# Altium schematic sheet Telemetria_Sensores.SchDoc
size A4; SheetNumber: 4; SheetTotal: 4
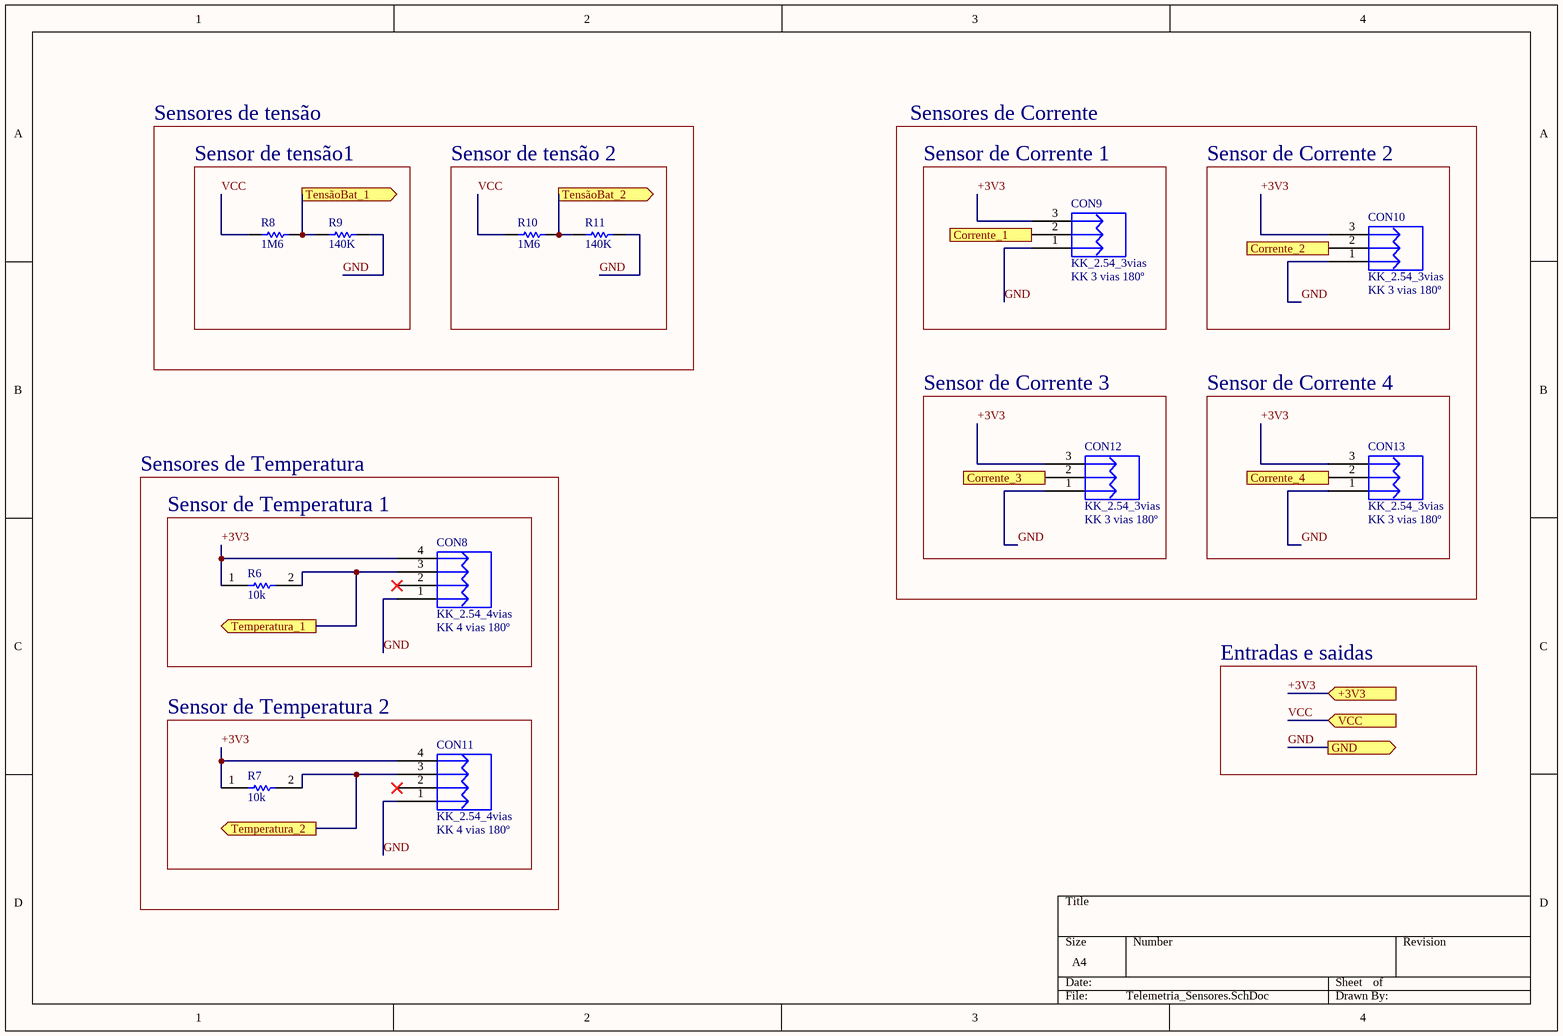
[diagram p0: Telemetria_Sensores.SchDoc]

## Parts
CON8  KK_2.54_4vias  Valor: KK 4 vias 180º  [KK_4vias_180°]
CON9  KK_2.54_3vias  Valor: KK 3 vias 180º  [KK_3vias_180º]
CON10  KK_2.54_3vias  Valor: KK 3 vias 180º  [KK_3vias_180º]
CON11  KK_2.54_4vias  Valor: KK 4 vias 180º  [KK_4vias_180°]
CON12  KK_2.54_3vias  Valor: KK 3 vias 180º  [KK_3vias_180º]
CON13  KK_2.54_3vias  Valor: KK 3 vias 180º  [KK_3vias_180º]
R6  10k  [RESC3216X60N]
R7  10k  [RESC3216X60N]
R8  1M6  [RESISTOR 0603]
R9  140K  [RESISTOR 0805]
R10  1M6  [RESISTOR 0603]
R11  140K  [RESISTOR 0805]

## Blocks framed on the sheet
Sensor de tensão1: R8 R9
Sensor de tensão 2: R10 R11
Sensor de Corrente 1: CON9
Sensor de Corrente 2: CON10
Sensor de Corrente 3: CON12
Sensor de Corrente 4: CON13
Sensor de Temperatura 1: CON8 R6
Sensor de Temperatura 2: CON11 R7

## Ports
+3V3 (in), Corrente_1 (out), Corrente_2 (out), Corrente_3 (out), Corrente_4 (out), GND (out), Temperatura_1 (out), Temperatura_2 (out), TensãoBat_1 (out), TensãoBat_2 (out), VCC (in)

## Nets
+3V3: CON8.4 CON9.3 CON10.3 CON11.4 CON12.3 CON13.3 R6.1 R7.1 ; port +3V3
Corrente_1: CON9.2 ; port Corrente_1
Corrente_2: CON10.2 ; port Corrente_2
Corrente_3: CON12.2 ; port Corrente_3
Corrente_4: CON13.2 ; port Corrente_4
GND: CON8.1 CON9.1 CON10.1 CON11.1 CON12.1 CON13.1 R9.2 R11.2 ; port GND
Temperatura_1: CON8.3 R6.2 ; port Temperatura_1
Temperatura_2: CON11.3 R7.2 ; port Temperatura_2
TensãoBat_1: R8.2 R9.1 ; port TensãoBat_1
TensãoBat_2: R10.2 R11.1 ; port TensãoBat_2
VCC: R8.1 R10.1 ; port VCC

Not connected (* = marked no-connect by the designer): CON8 2*; CON11 2*

## Notes on the sheet
- Sensores de tensão
- Sensores de Corrente
- Sensores de Temperatura
- Entradas e saidas

## Library data of the parts
CON8 CON11 = KK_2.54_4vias: Conector KK 2.54mm 4 vias; Descrição: Conector KK 3 vias com passo 2.54mm; Encapsulamento: PTH - 180º; Modelo: 3 vias - 180º; Marca: *; Observação: *
CON9 CON10 CON12 CON13 = KK_2.54_3vias: Conector KK 2.54mm 3 vias; Descrição: Conector KK 3 vias com passo 2.54mm; Encapsulamento: PTH - 180º; Modelo: 3 vias - 180º; Marca: *; Observação: *
R6 R7 = Resistor 1206: Resistor; Manufacturer_Name: Vishay; Manufacturer_Part_Number: CRCW12064K70FKEA; Datasheet Link: http://docs-emea.rs-online.com/webdocs/13ec/0900766b813ecc08.pdf; Height: 0.6mm; Mouser Part Number: 71-CRCW1206-4.7K-E3; Mouser Price/Stock: https://www.mouser.co.uk/ProductDetail/Vishay-Dale/CRCW12064K70FKEA?qs=1vm4qhDHCvlKJmatsKzyFQ%3D%3D; Arrow Part Number: CRCW12064K70FKEA; Arrow Price/Stock: https://www.arrow.com/en/products/crcw12064k70fkea/vishay
R8 R10 = RES 0603 5%: 0603; Manufacturer: PANASONIC ELECTRONIC COMPONENTS; Manufacturer Part Number: ERJ-3GEY0R00V; Product Range: AEC-Q200 ERJ3; Resistance: 0; Power Rating: 100; Voltage Rating: 75; Resistor Case Style: 0603 [1608 Metric]; Resistance (Ohms): 0.0; Tolerance: Jumper; Power (Watts): 0.1W, 1/10W; Brand: Panasonic; Qualification: AEC-Q200; RoHS: YES; Resistance Tolerance: -; Packaging: Cut Tape; MSL: -; ComponentLink1URL: http://www.farnell.com/cad/1697908.zip; ComponentLink1Description: http://www.farnell.com/cad/1697908.zip; ComponentLink2URL: http://www.farnell.com/datasheets/1678796.pdf; ComponentLink2Description: http://www.farnell.com/datasheets/1678796.pdf; Category: Resistors; Composition: Thick Film; Features: Automotive AEC-Q200; Temperature Coefficient: -; Operating Temperature: -55°C ~ 155°C; Package / Case: 0603 (1608 Metric); Supplier Device Package: 0603; Size / Dimension: 0.063" L x 0.031" W (1.60mm x 0.80mm); Height: 0.022" (0.55mm); Number of Terminations: 2; ComponentLink3URL: http://industrial.panasonic.com/www-cgi/jvcr13pz.cgi?E+PZ+3+AOA0001+ERJ3GEY0R00V+7+WW; ComponentLink3Description: http://industrial.panasonic.com/www-cgi/jvcr13pz.cgi?E+PZ+3+AOA0001+ERJ3GEY0R00V+7+WW; Supplier 1: Mouser; Stock 1: 1987085; Pricing 1: 1=0.160, 10=0.019, 100=0.013, 500=0.010, 1000=0.005, 5000=0.003 (AUD); Length: 1.6 mm; Operating Temperature Range: - 55 C to + 155 C; Product: Thick Film Resistors Zero-Ohm; Series: ERJ; Termination Style: SMD/SMT; Type: Thick Film Resistors SMD; Width: 0.8 mm; Case Code - in: 0603; Case Code - mm: 1608; RoHS - Mouser: E; Minimum Order Quantity: 1; Reeling: True; ComponentLink4URL: http://www.mouser.com/ds/2/315/AOA0000C84-947596.pdf; ComponentLink4Description: http://www.mouser.com/ds/2/315/AOA0000C84-947596.pdf; Supplier Part Number 1: 667-ERJ-3GEY0R00V
R9 R11 = RES 0805 5%: 0805; Manufacturer: PANASONIC ELECTRONIC COMPONENTS; Manufacturer Part Number: ERJ-3GEY0R00V; Product Range: AEC-Q200 ERJ3; Resistance: 0; Power Rating: 100; Voltage Rating: 75; Resistor Case Style: 0603 [1608 Metric]; Resistance (Ohms): 0.0; Tolerance: Jumper; Power (Watts): 0.1W, 1/10W; Brand: Panasonic; Qualification: AEC-Q200; RoHS: YES; Resistance Tolerance: -; Packaging: Cut Tape; MSL: -; ComponentLink1URL: http://www.farnell.com/cad/1697908.zip; ComponentLink1Description: http://www.farnell.com/cad/1697908.zip; ComponentLink2URL: http://www.farnell.com/datasheets/1678796.pdf; ComponentLink2Description: http://www.farnell.com/datasheets/1678796.pdf; Category: Resistors; Composition: Thick Film; Features: Automotive AEC-Q200; Temperature Coefficient: -; Operating Temperature: -55°C ~ 155°C; Package / Case: 0603 (1608 Metric); Supplier Device Package: 0603; Size / Dimension: 0.063" L x 0.031" W (1.60mm x 0.80mm); Height: 0.022" (0.55mm); Number of Terminations: 2; ComponentLink3URL: http://industrial.panasonic.com/www-cgi/jvcr13pz.cgi?E+PZ+3+AOA0001+ERJ3GEY0R00V+7+WW; ComponentLink3Description: http://industrial.panasonic.com/www-cgi/jvcr13pz.cgi?E+PZ+3+AOA0001+ERJ3GEY0R00V+7+WW; Supplier 1: Mouser; Stock 1: 1987085; Pricing 1: 1=0.160, 10=0.019, 100=0.013, 500=0.010, 1000=0.005, 5000=0.003 (AUD); Length: 1.6 mm; Operating Temperature Range: - 55 C to + 155 C; Product: Thick Film Resistors Zero-Ohm; Series: ERJ; Termination Style: SMD/SMT; Type: Thick Film Resistors SMD; Width: 0.8 mm; Case Code - in: 0603; Case Code - mm: 1608; RoHS - Mouser: E; Minimum Order Quantity: 1; Reeling: True; ComponentLink4URL: http://www.mouser.com/ds/2/315/AOA0000C84-947596.pdf; ComponentLink4Description: http://www.mouser.com/ds/2/315/AOA0000C84-947596.pdf; Supplier Part Number 1: 667-ERJ-3GEY0R00V